# EAGLE design Qwiic_MultiStar (EAGLE 9.6.2)
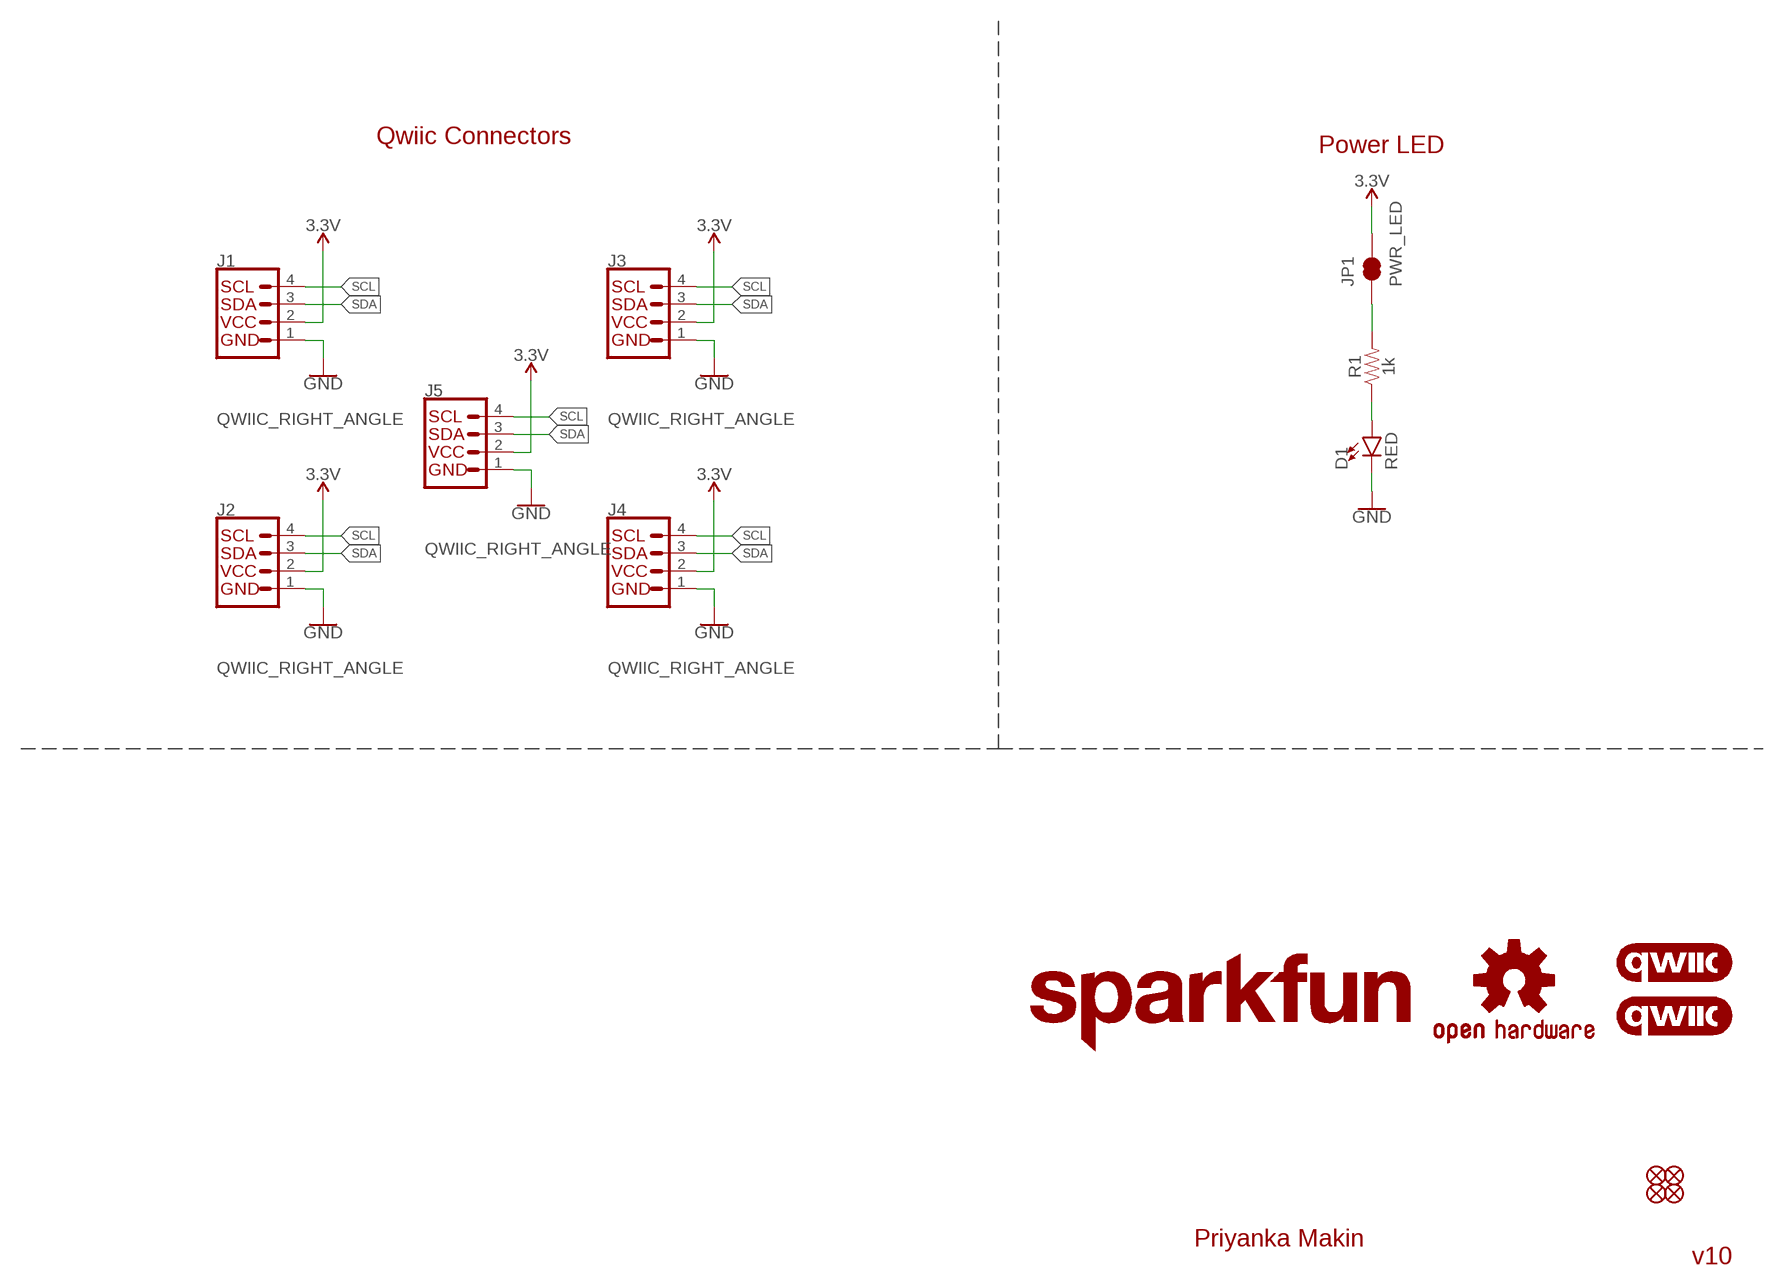
[diagram p0: schematic, sheet 1]

## Parts
D1  RED  LED-RED0603  [LED-0603]
FD1  FIDUCIAL1X2  [FIDUCIAL-1X2]
FD2  FIDUCIAL1X2  [FIDUCIAL-1X2]
FD3  FIDUCIAL1X2  [FIDUCIAL-1X2]
FD4  FIDUCIAL1X2  [FIDUCIAL-1X2]
J1  QWIIC_RIGHT_ANGLE  QWIIC_CONNECTORJS-1MM  [JST04_1MM_RA]
J2  QWIIC_RIGHT_ANGLE  QWIIC_CONNECTORJS-1MM  [JST04_1MM_RA]
J3  QWIIC_RIGHT_ANGLE  QWIIC_CONNECTORJS-1MM  [JST04_1MM_RA]
J4  QWIIC_RIGHT_ANGLE  QWIIC_CONNECTORJS-1MM  [JST04_1MM_RA]
J5  QWIIC_RIGHT_ANGLE  QWIIC_CONNECTORJS-1MM  [JST04_1MM_RA]
JP1  PWR_LED  JUMPER-SMT_2_NC_TRACE_SILK  [SMT-JUMPER_2_NC_TRACE_SILK]
LOGO1  QWIIC_LOGO_5MM  [QWIIC_5MM]
LOGO2  QWIIC_LOGO_5MM  [QWIIC_5MM]
LOGO3  OSHW-LOGOS  [OSHW-LOGO-S]
LOGO4  SFE_LOGO_NAME.2_INCH  [SFE_LOGO_NAME_.2]
R1  1k  1KOHM-0603-1/10W-1%  [0603]

## Nets
3.3V: J1.2 J2.2 J3.2 J4.2 J5.2 JP1.2
GND: D1.C J1.1 J2.1 J3.1 J4.1 J5.1
N$1: D1.A R1.1
N$2: JP1.1 R1.2
SCL: J1.4 J2.4 J3.4 J4.4 J5.4
SDA: J1.3 J2.3 J3.3 J4.3 J5.3

## Notes on the sheet
- Qwiic Connectors
- Power LED
- Priyanka Makin
- v10

## Library data of the parts
D1 = SparkFun-LED:LED-RED: Red SMD LED Used in manufacturing of most products at SparkFun Packages: 0603 - SMD 0603 package [Product Link] <http://docs.avagotech.com/docs/AV02-0551EN> 0603 SMART - SMD 0603 SMART package ( more efficient and expensive)[Product Link] <http://www.osram-os.com/Graphics/XPic2/00077099_0.pdf> 1206 - SMD1206 package [Product Link] <https://www.sparkfun.com/datasheets/DevTools/LilyPad/Q150OVS4.pdff> SparkFun Products: Pro Mini 328 -5V <https://www.sparkfun.com/products/821> RedBoard <https://www.sparkfun.com/products/12757> IOIO-OTG <https://www.sparkfun.com/products/13613>; PROD_ID: DIO-00819
FD1-FD4 = SparkFun-Aesthetics:FIDUCIAL: Fiducial Alignment Points Point-of-reference for pick-and-place machines and other optical instruments.
J1-J5 = SparkFun-Connectors:QWIIC_CONNECTOR: SparkFun I2C Standard Qwiic Connector An SMD 1mm pitch JST connector makes it easy and quick (get it? Qwiic?) to connect I2C devices to each other. The Qwiic system <http://www.sparkfun.com/qwiic> enables fast and solderless connection between popular platforms and various sensors and actuators. We carry 200mm <https://www.sparkfun.com/products/14204>, 100mm <https://www.sparkfun.com/products/14205>, 50mm <https://www.sparkfun.com/products/14206>, and breadboard friendly <https://www.sparkfun.com/products/14207> Qwiic cables. We also offer 10 pcs strips <https://www.sparkfun.com/products/14323> the SMD connectors.; PROD_ID: CONN-13694
JP1 = SparkFun-Jumpers:JUMPER-SMT_2_NC_TRACE: Normally closed trace jumper This jumper has a trace between two pads so it's normally closed (NC). Use a razor knife to open the connection. For best results follow the IPC guidelines for cutting traces: Cutout at least 0.063 mm (0.005 in). Remove all loose material to clean up the cut area. Seal the cut with an approved epoxy. Reapply solder to reclose the connection.
LOGO1 LOGO2 = SparkFun-Aesthetics:QWIIC_LOGO: Qwiic Logos for placement on schematic and PCB. The 5.5mm silk logo is best for placing next to Qwiic connector.
LOGO3 = SparkFun-Aesthetics:OSHW-LOGO: Open-Source Hardware (OSHW) Logo This logo indicates the piece of hardware it is found on incorporates a OSHW license and/or adheres to the definition of open source hardware found here: http://freedomdefined.org/OSHW
LOGO4 = SparkFun-Aesthetics:SFE_LOGO_NAME: SparkFun Font Logo This is the SparkFun name logo. The logo on the schematic will always be the same size; the package variant is the height of the flame part of the logo (or the height the flame would be, if it were drawn). Default layer for the logo on the board is tSilk.
R1 = SparkFun-Resistors:1KOHM: 1kΩ resistor A resistor is a passive two-terminal electrical component that implements electrical resistance as a circuit element. Resistors act to reduce current flow, and, at the same time, act to lower voltage levels within circuits. - Wikipedia; PROD_ID: RES-07856

## Board
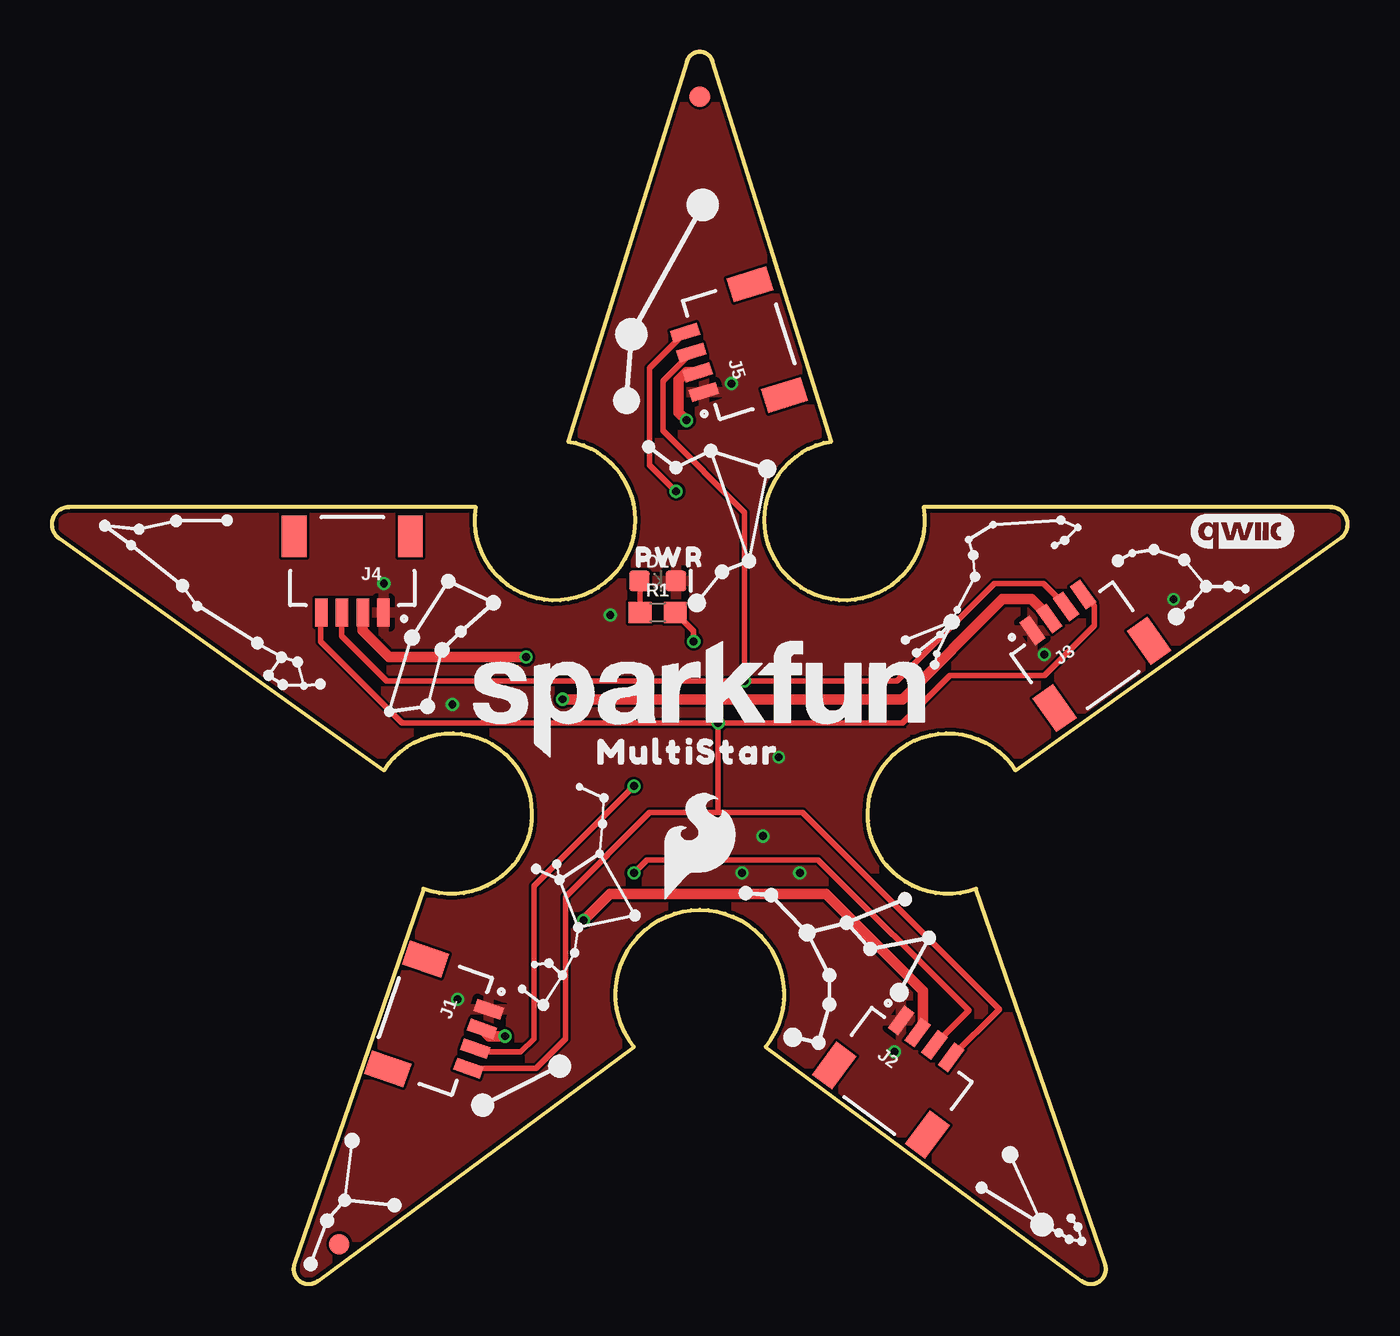
[diagram p1: board, top side]
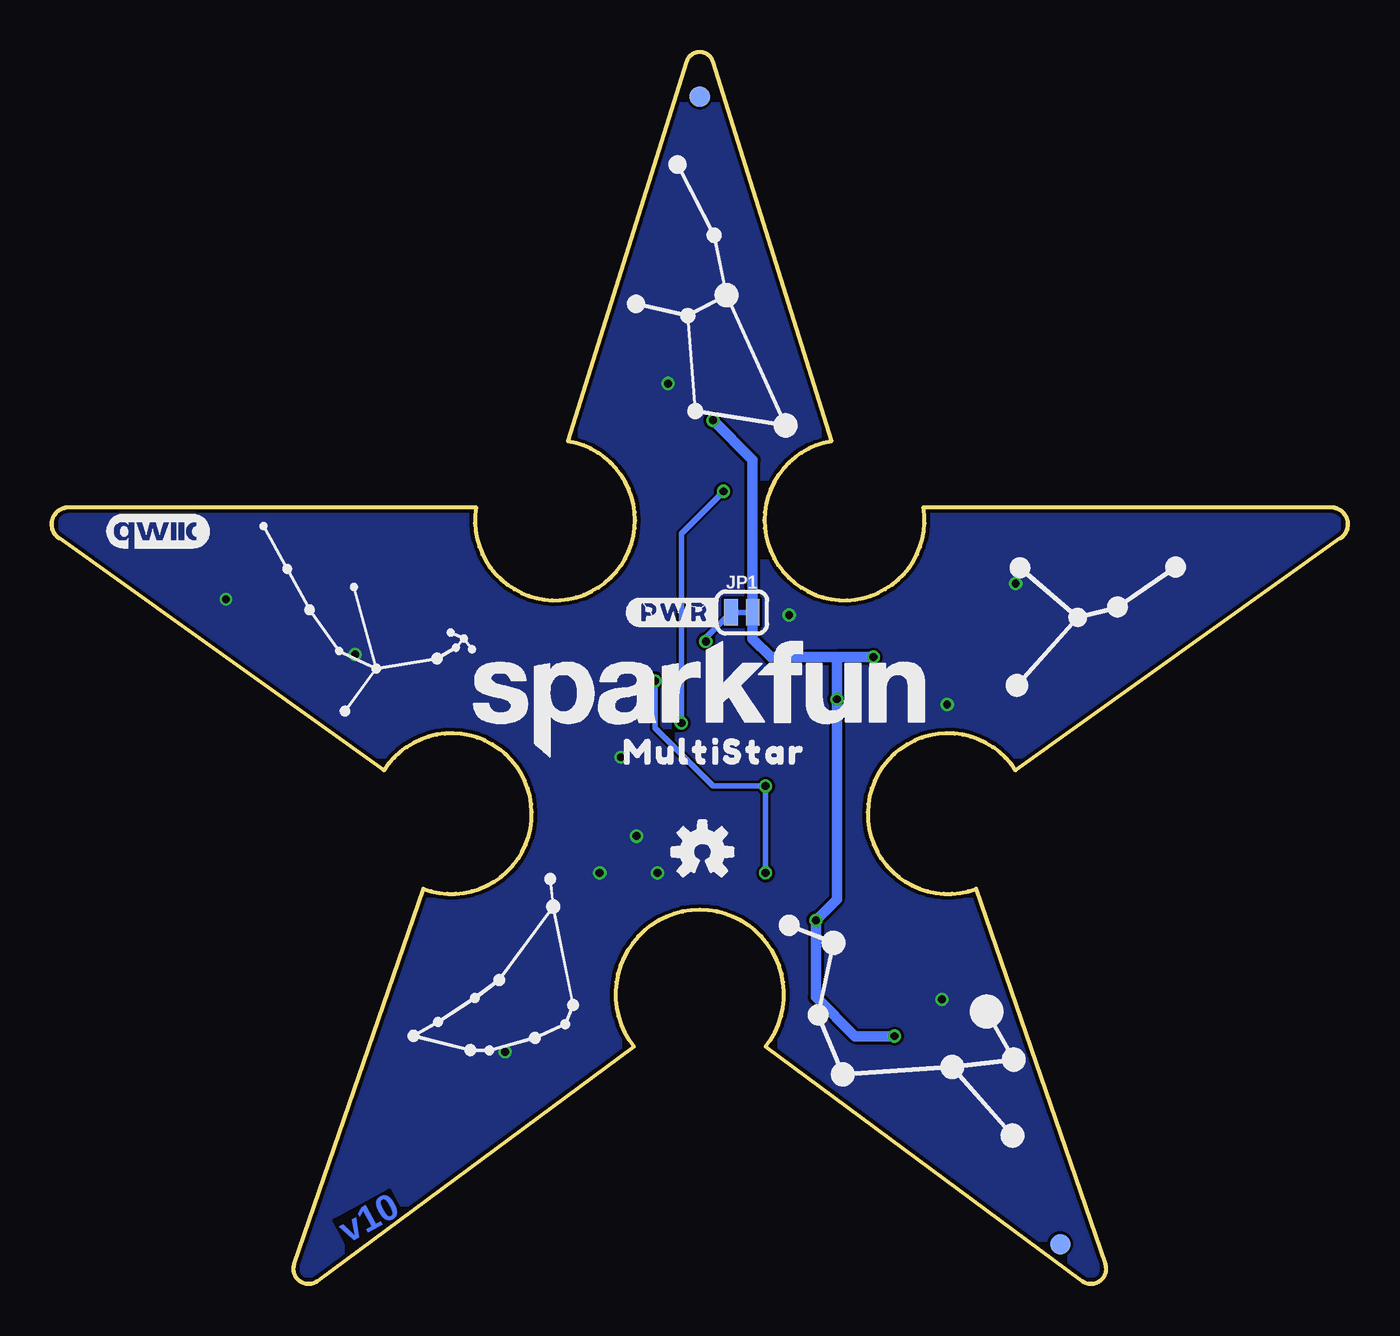
[diagram p2: board, bottom side, seen from below]

Size 62.53 x 59.46 mm. Coordinates in mm from the lower left corner, seen from the top.
Outline: 37.61,40.66 31.88,59 arc145 30.65,59 24.91,40.66 arc-270 20.47,37.49 0.83,37.49 arc144 0.35,35.98 16.02,24.79 arc-258 17.93,19.07 11.7,0.96 arc145 12.82,0.14 28.09,11.45 arc-257 34.44,11.45 49.71,0.14 arc145 50.82,0.96 44.6,19.07 arc-258 46.5,24.79 62.18,35.98 arc144 61.7,37.49 42.06,37.49 arc-270 37.61,40.66
Copper layers (1*16): Top 0.035mm / dielectric 1.5mm / Bottom 0.035mm
Design rules "SparkFun-2-Layer-Minimum-JLCPCB": minimum track width 5mil, minimum drill 0.3mm, track to track 5mil, track to pad 5mil, pad to pad 5mil, via to via 5mil, smd to smd 5mil, copper to edge 7mil, drill to drill 7mil, minimum pad ring 5mil, minimum via ring 5mil, stop-mask expansion 2.5mil, vias tented up to drill 25mil, thermal gap 10mil

### Footprints (pad centres in the part's own frame; a part is rotated, then mirrored left to right if it is on the bottom)
LED-0603 = smd 1 x 1: A -0.877,0; C 0.877,0
FIDUCIAL-1X2 = smd 1 x 1: 1 0,0
JST04_1MM_RA = smd 0.6 x 1.35: 1 -1.5,0; 2 -0.5,0; 3 0.5,0; 4 1.5,0 | smd 1.2 x 2: NC1 2.8,-3.675; NC2 -2.8,-3.675
SMT-JUMPER_2_NC_TRACE_SILK = smd 0.66 x 1.27: 1 -0.521,0; 2 0.521,0
0603 = smd 1.1 x 1: 1 -0.85,0; 2 0.85,0

### Placement (x,y rotation side)
D1  29.23,33.93 0 top
FD1  13.87,1.93 0 top
FD2  13.87,1.93 0 bottom
FD3  31.26,57.3 0 top
FD4  31.26,57.3 0 bottom
FRAME1  FRAME-LETTER  [CREATIVE_COMMONS]  13.48,-12.68 0 top  (outside the outline)
J1  20.6,11.83 251 top
J2  42.19,11.83 323.5 top
J3  48.54,32.41 35.5 top
J4  14.5,32.41 180 top
J5  31.01,44.47 107.4 top
JP1  29.23,32.41 0 bottom
LOGO1  57.43,36.34 0 bottom
LOGO2  57.43,36.34 0 top
LOGO3  31.14,20.85 0 bottom
LOGO4  31.26,28.21 0 bottom
LOGO5  SFE_LOGO_NAME.2_INCH  [SFE_LOGO_NAME_.2]  31.26,28.21 0 top
R1  29.23,32.41 0 top
U$2  [SFE_LOGO_FLAME_.2]  31.26,21.1 0 top
U$3  [MULTISTAR0]  25.42,25.67 0 top
U$5  [MULTISTAR0]  35.84,25.67 0 bottom
U$6  [#PWR#0]  34.82,32.41 0 bottom
U$9  [PWR0]  27.45,35.07 0 top

### Tracks (layer width: path | path; a pad name or v marks a point on that pad's centre or on a via)
3.3V  (via drill 0.38)
  Top 0.508: v24.65,28.21 41.04,28.21 45.87,33.04 47.27,33.04 48.13,32.18 J3.2 | v22.88,30.25 16.28,30.25 15,31.52 J4.2 | v30.63,41.68 30.25,42.06 30.25,43.62 30.62,43.99 J5.2 | v25.66,17.55 26.93,18.82 37.36,18.82 42.04,14.14 42.04,12.38 J2.2 | v21.87,11.96 21.11,11.96 J1.2
  Bottom 0.508: v21.87,11.96 23.77,11.96 25.66,13.85 v25.66,17.55 24.65,18.56 v24.65,28.21 24.65,30.25 | v30.63,41.68 28.71,39.76 JP1.2 28.71,31.12 27.84,30.25 24.65,30.25 | v22.88,30.25 24.65,30.25
GND  (via drill 0.35, 0.38)
  other vias: 16.02,33.8 26.95,32.28 32.79,43.45 47.9,30.37 40.66,11.2 19.58,13.74 54.12,33.04 35.07,25.42 34.31,21.61 19.33,27.96 33.3,19.83 36.09,19.83
  pour Top: -0.49,-1.25 64.28,-1.25 64.28,60.98 -0.49,60.98
  pour Bottom: -0.49,-1.25 64.28,-1.25 64.28,60.98 -0.49,60.98
N$1
  Top 0.254: D1.A 28.38,33.9 R1.1
N$2  (via drill 0.38)
  Top 0.254: R1.2 30.97,31.52 v30.97,31.01
  Bottom 0.254: JP1.1 30.97,31.19 v30.97,31.01
SCL  (via drill 0.38)
  Top 0.254: v32.15,27.07 41.04,27.07 43.33,29.36 47.9,29.36 50.31,31.77 50.31,32.72 J3.4 | 32.15,22.75 v32.15,27.07 | 32.15,22.75 36.22,22.75 45.71,13.26 J2.4 | 32.15,22.75 28.85,22.75 24.79,18.69 24.79,11.83 23.37,10.41 J1.4 | v30.12,38.25 28.85,39.52 28.85,44.19 J5.4 | v32.15,27.07 16.91,27.07 12.98,31.01 12.98,32.38 J4.4
  Bottom 0.254: v30.12,38.25 32.15,36.22 v32.15,27.07
SDA  (via drill 0.38)
  Top 0.254: v33.42,29.1 40.79,29.1 45.49,33.8 47.84,33.8 J3.3 | v28.09,24.02 23.26,19.2 23.26,11.83 22.63,11.2 20.6,11.2 J1.3 | v28.09,19.83 28.72,20.47 36.98,20.47 44.25,13.2 J2.3 | v33.42,29.1 33.42,37.23 29.49,41.17 29.49,43.58 J5.3 | v33.42,29.1 16.15,29.1 13.99,31.26 13.99,32.4 J4.3
  Bottom 0.254: v33.42,29.1 33.42,26.82 30.63,24.02 v28.09,24.02 v28.09,19.83

### Text on the board
Bottom: v10
tDocu: Priyanka Makin